# EasyEDA schematic sch_knx-valve-control_v1.2.json
TITLE: KNX 8 Heating Actuators Control; REV: 1.2; Date: 2025-16-12; Sheet: 1/1; Company: LL Production
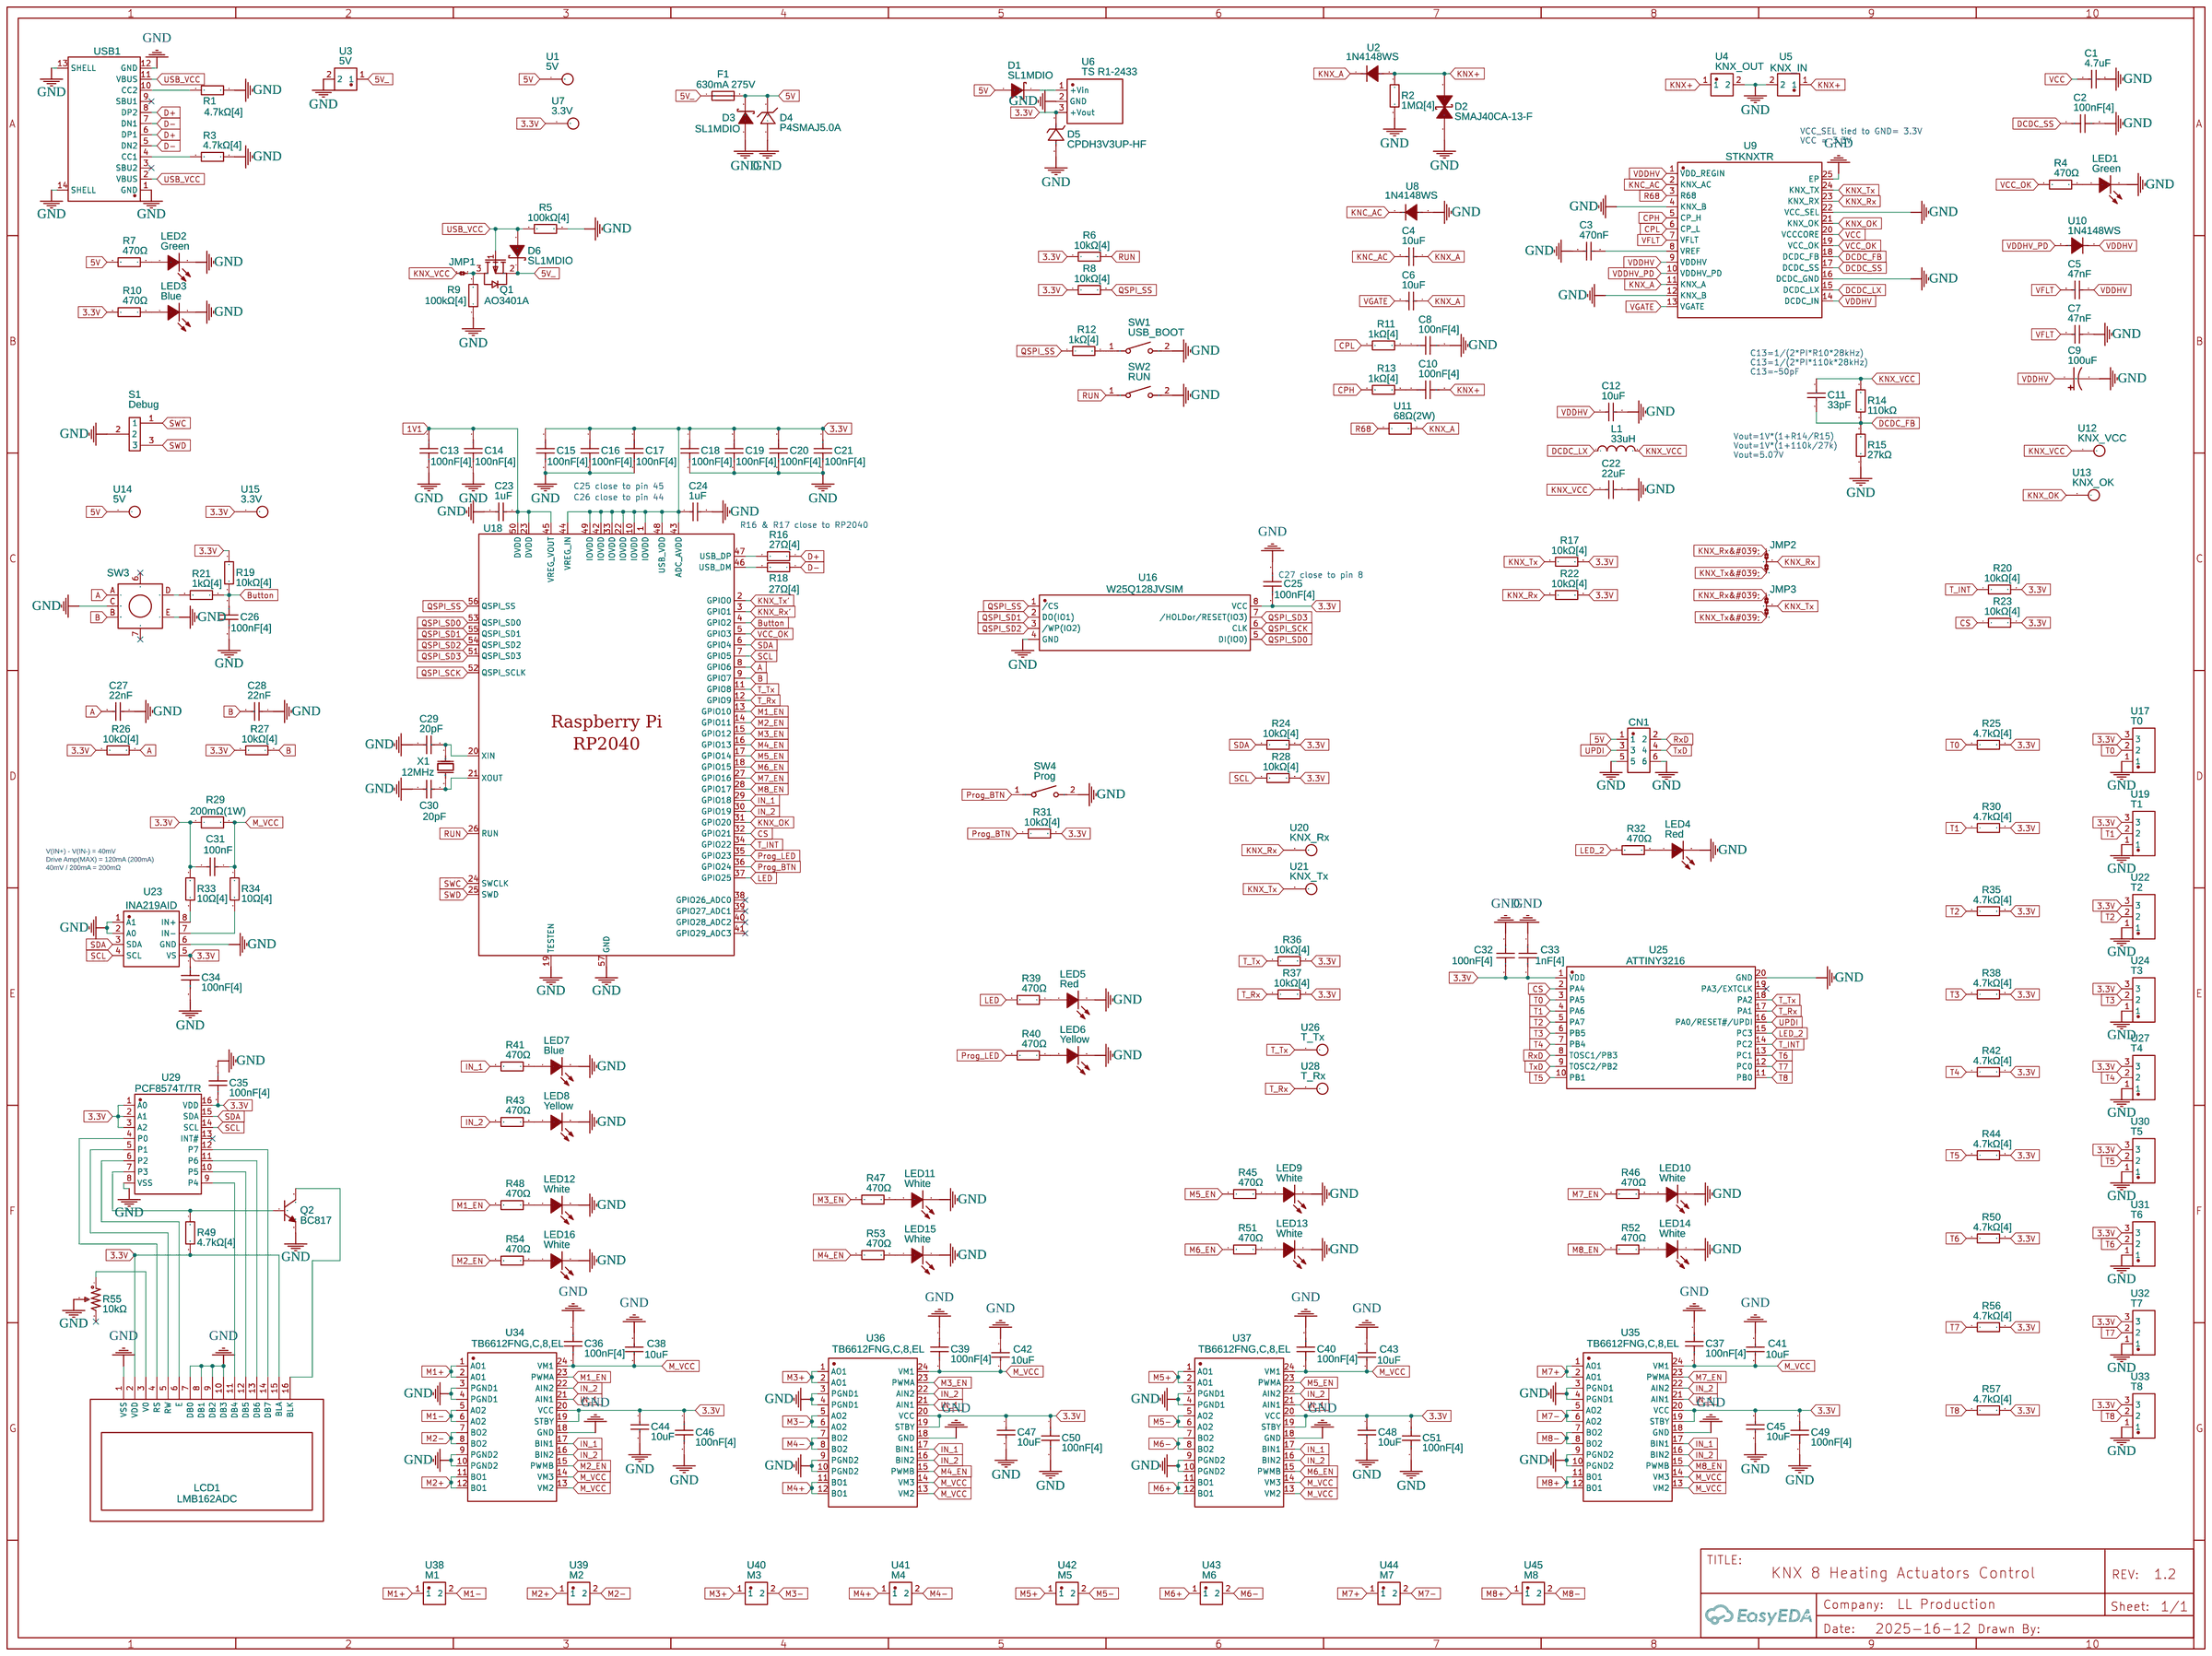
[diagram p0: schematic sheet]

## Parts
C1  4.7uF  [C0603]
C2  100nF[4]  [C0402]
C3  470nF  [C0603]
C4  10uF  [C0603]
C5  47nF  [C0603]
C6  10uF  [C0603]
C7  47nF  [C0603]
C8  100nF[4]  [C0402]
C9  100uF  [CAP-SMD_BD8.0-L8.3-W8.3-RD]
C10  100nF[4]  [C0402]
C11  33pF  [C0603]
C12  10uF  [C0603]
C13  100nF[4]  [C0402]
C14  100nF[4]  [C0402]
C15  100nF[4]  [C0402]
C16  100nF[4]  [C0402]
C17  100nF[4]  [C0402]
C18  100nF[4]  [C0402]
C19  100nF[4]  [C0402]
C20  100nF[4]  [C0402]
C21  100nF[4]  [C0402]
C22  22uF  [C0603]
C23  1uF  [C0603]
C24  1uF  [C0603]
C25  100nF[4]  [C0402]
C26  100nF[4]  [C0402]
C27  22nF  [C0603]
C28  22nF  [C0603]
C29  20pF  [C0603]
C30  20pF  [C0603]
C31  100nF  [C0603]
C32  100nF[4]  [C0402]
C33  1nF[4]  [C0402]
C34  100nF[4]  [C0402]
C35  100nF[4]  [C0402]
C36  100nF[4]  [C0402]
C37  100nF[4]  [C0402]
C38  10uF  [C0603]
C39  100nF[4]  [C0402]
C40  100nF[4]  [C0402]
C41  10uF  [C0603]
C42  10uF  [C0603]
C43  10uF  [C0603]
C44  10uF  [C0603]
C45  10uF  [C0603]
C46  100nF[4]  [C0402]
C47  10uF  [C0603]
C48  10uF  [C0603]
C49  100nF[4]  [C0402]
C50  100nF[4]  [C0402]
C51  100nF[4]  [C0402]
CN1  321006SG0ABK00A01  [IDC-TH_321006SG0ABK00A01]
D1  SL1MDIO  [SOD-123_L2.7-W1.6-LS3.7-RD]
D2  SMAJ40CA-13-F  [SMA_L4.4-W2.6-LS5.0-BI]
D3  SL1MDIO  [SOD-123_L2.7-W1.6-LS3.7-RD]
D4  P4SMAJ5.0A  [SMA_L4.3-W2.6-LS5.2-RD]
D5  CPDH3V3UP-HF  [SOD-523_L1.2-W0.8-LS1.6-RD-1]
D6  SL1MDIO  [SOD-123_L2.7-W1.6-LS3.7-RD]
F1  630mA 275V  [FUSE-SMD_L10.1-W3.1]
JMP1  Rx  [JMP-2-NO-0603]
JMP2  JMP-3-NO-0402  [JMP-3-NO-0402]
JMP3  JMP-3-NO-0402  [JMP-3-NO-0402]
L1  33uH  [IND-SMD_L4.9-W4.9_NRS50XX]
LCD1  LMB162ADC  [LCD1602]
LED1  Green  [LED0603-R-RD]
LED2  Green  [LED0603-R-RD]
LED3  Blue  [LED0603-R-RD]
LED4  Red  [LED0603-R-RD]
LED5  Red  [LED0603-R-RD]
LED6  Yellow  [LED0603-R-RD]
LED7  Blue  [LED0603-R-RD]
LED8  Yellow  [LED0603-R-RD]
LED9  White  [LED0603-R-RD]
LED10  White  [LED0603-R-RD]
LED11  White  [LED0603-R-RD]
LED12  White  [LED0603-R-RD]
LED13  White  [LED0603-R-RD]
LED14  White  [LED0603-R-RD]
LED15  White  [LED0603-R-RD]
LED16  White  [LED0603-R-RD]
Q1  AO3401A  [SOT-23-3_L2.9-W1.3-P1.90-LS2.4-BR]
Q2  BC817  [SOT-23-3_L2.9-W1.6-P1.90-LS2.8-BR]
R1  4.7kΩ[4]  [R0402]
R2  1MΩ[4]  [R0402]
R3  4.7kΩ[4]  [R0402]
R4  470Ω  [R0603]
R5  100kΩ[4]  [R0402]
R6  10kΩ[4]  [R0402]
R7  470Ω  [R0603]
R8  10kΩ[4]  [R0402]
R9  100kΩ[4]  [R0402]
R10  470Ω  [R0603]
R11  1kΩ[4]  [R0402]
R12  1kΩ[4]  [R0402]
R13  1kΩ[4]  [R0402]
R14  110kΩ  [R0603]
R15  27kΩ  [R0603]
R16  27Ω[4]  [R0402]
R17  10kΩ[4]  [R0402]
R18  27Ω[4]  [R0402]
R19  10kΩ[4]  [R0402]
R20  10kΩ[4]  [R0402]
R21  1kΩ[4]  [R0402]
R22  10kΩ[4]  [R0402]
R23  10kΩ[4]  [R0402]
R24  10kΩ[4]  [R0402]
R25  4.7kΩ[4]  [R0402]
R26  10kΩ[4]  [R0402]
R27  10kΩ[4]  [R0402]
R28  10kΩ[4]  [R0402]
R29  200mΩ(1W)  [R1206]
R30  4.7kΩ[4]  [R0402]
R31  10kΩ[4]  [R0402]
R32  470Ω  [R0603]
R33  10Ω[4]  [R0402]
R34  10Ω[4]  [R0402]
R35  4.7kΩ[4]  [R0402]
R36  10kΩ[4]  [R0402]
R37  10kΩ[4]  [R0402]
R38  4.7kΩ[4]  [R0402]
R39  470Ω  [R0603]
R40  470Ω  [R0603]
R41  470Ω  [R0603]
R42  4.7kΩ[4]  [R0402]
R43  470Ω  [R0603]
R44  4.7kΩ[4]  [R0402]
R45  470Ω  [R0603]
R46  470Ω  [R0603]
R47  470Ω  [R0603]
R48  470Ω  [R0603]
R49  4.7kΩ[4]  [R0402]
R50  4.7kΩ[4]  [R0402]
R51  470Ω  [R0603]
R52  470Ω  [R0603]
R53  470Ω  [R0603]
R54  470Ω  [R0603]
R55  10kΩ  [RES-ADJ-SMD_3P-L3.0-W3.8-P1.75-BR]
R56  4.7kΩ[4]  [R0402]
R57  4.7kΩ[4]  [R0402]
S1  Debug  [3PAD_SEL]
SW1  USB_BOOT  [SW-SMD_4P-L3.7-W3.0-P1.50-LS4.7]
SW2  RUN  [SW-SMD_4P-L3.7-W3.0-P1.50-LS4.7]
SW3  EC11L1525G01  [SW-TH_ALPS_EC11L1525G01]
SW4  Prog  [SW-SMD_4P-L3.7-W3.0-P1.50-LS4.7]
U1  5V  [THROUGH-HOLE-0.66]
U2  1N4148WS  [SOD-323_L1.7-W1.3-LS2.7-RD]
U3  5V  [CONN-TH_2P-P5.08_C9900012979]
U4  KNX_OUT  [CONN-TH_2P-P5.08_C9900012979]
U5  KNX_IN  [CONN-TH_2P-P5.08_C9900012979]
U6  TS R1-2433  [PWRM-TH_3P-L11.7-W7.6-P2.54_R1-2433]
U7  3.3V  [THROUGH-HOLE-0.66]
U8  1N4148WS  [SOD-323_L1.7-W1.3-LS2.7-RD]
U9  STKNXTR  [VFQFPN-24_L4.0-W4.0-P0.50-BL-EP2.8]
U10  1N4148WS  [SOD-323_L1.7-W1.3-LS2.7-RD]
U11  68Ω(2W)  [R2512]
U12  KNX_VCC  [THROUGH-HOLE-0.66]
U13  KNX_OK  [THROUGH-HOLE-0.66]
U14  5V  [THROUGH-HOLE-0.66]
U15  3.3V  [THROUGH-HOLE-0.66]
U16  W25Q128JVSIM  [SOIC-8_L5.2-W5.2-P1.27-LS7.9-BL]
U17  T0  [CONN-TH_3P-P5.08_DB127V-5.08-3P-GN-S]
U18  RP2040  [LQFN-56_L7.0-W7.0-P0.4-EP]
U19  T1  [CONN-TH_3P-P5.08_DB127V-5.08-3P-GN-S]
U20  KNX_Rx  [THROUGH-HOLE-0.66]
U21  KNX_Tx  [THROUGH-HOLE-0.66]
U22  T2  [CONN-TH_3P-P5.08_DB127V-5.08-3P-GN-S]
U23  INA219AID  [SOIC-8_L4.9-W3.9-P1.27-LS6.0-BL]
U24  T3  [CONN-TH_3P-P5.08_DB127V-5.08-3P-GN-S]
U25  ATTINY3216  [SOIC-20_L13.0-W7.6-P1.27-LS10.3-BL]
U26  T_Tx  [THROUGH-HOLE-0.66]
U27  T4  [CONN-TH_3P-P5.08_DB127V-5.08-3P-GN-S]
U28  T_Rx  [THROUGH-HOLE-0.66]
U29  PCF8574T/TR  [SO-16_L10.3-W7.5-P1.27-LS10.3-BL]
U30  T5  [CONN-TH_3P-P5.08_DB127V-5.08-3P-GN-S]
U31  T6  [CONN-TH_3P-P5.08_DB127V-5.08-3P-GN-S]
U32  T7  [CONN-TH_3P-P5.08_DB127V-5.08-3P-GN-S]
U33  T8  [CONN-TH_3P-P5.08_DB127V-5.08-3P-GN-S]
U34  TB6612FNG,C,8,EL  [SSOP-24_L8.3-W5.6-P0.65-LS7.6-BL]
U35  TB6612FNG,C,8,EL  [SSOP-24_L8.3-W5.6-P0.65-LS7.6-BL]
U36  TB6612FNG,C,8,EL  [SSOP-24_L8.3-W5.6-P0.65-LS7.6-BL]
U37  TB6612FNG,C,8,EL  [SSOP-24_L8.3-W5.6-P0.65-LS7.6-BL]
U38  M1  [CONN-TH_2P-P5.08_C9900012979]
U39  M2  [CONN-TH_2P-P5.08_C9900012979]
U40  M3  [CONN-TH_2P-P5.08_C9900012979]
U41  M4  [CONN-TH_2P-P5.08_C9900012979]
U42  M5  [CONN-TH_2P-P5.08_C9900012979]
U43  M6  [CONN-TH_2P-P5.08_C9900012979]
U44  M7  [CONN-TH_2P-P5.08_C9900012979]
U45  M8  [CONN-TH_2P-P5.08_C9900012979]
USB1  TYPE-C 16PIN 2MD(073)  [USB-C-SMD_TYPE-C-6PIN-2MD-073]
X1  12MHz  [OSC-SMD_L5.0-W3.2]

## Library data of the parts
C1 C3-C7 C11 C12 C22-C24 C27-C31 C38 C41-C45 C47 C48 = CC0603KRX7R9BB103: Supplier: LCSC; Manufacturer: YAGEO; Supplier Part: C100042; JLCPCB Part Class: Extended Part
C2 C8 C10 C13-C21 C25 C26 C32-C37 C39 C40 C46 C49-C51 = GRM155R71H104KE14D: Supplier: LCSC; Manufacturer: muRata(村田); Supplier Part: C77020; JLCPCB Part Class: Extended Part
C9 = VEJ101M1HTR-0810: Contributor: LCSC; Supplier: LCSC; Supplier Part: C176665; Manufacturer: Lelon(立隆); JLCPCB Part Class: Extended Part
CN1 = 321006SG0ABK00A01: Contributor: LCSC; Supplier: LCSC; Supplier Part: C601936; Manufacturer: JILN(锦凌); JLCPCB Part Class: Extended Part; link: https://lcsc.com/eda_search?q=C601936&%26type=1&ref=editor
D1 D3 D6 = 1N5819HW-7-F: Supplier: LCSC; Manufacturer: DIODES(美台); Supplier Part: C82544; JLCPCB Part Class: Extended Part
D2 = SMAJ40CA-13-F: Contributor: LCSC; Supplier: LCSC; Manufacturer: DIODES(美台); Supplier Part: C134986; JLCPCB Part Class: Extended Part
D4 = P4SMAJ12A-PEC: Contributor: LCSC; Supplier: LCSC; Supplier Part: C263332; Manufacturer: PANJIT(强茂); Manufacturer Part: P4SMAJ12A_R1_00001; JLCPCB Part Class: Extended Part
D5 = SOD-523: Contributor: LCSC; Supplier: LCSC; Supplier Part: C9900005315; Manufacturer: null; JLCPCB Part Class: Extended Part
F1 = S1032-F-60.0A: Contributor: LCSC; Supplier: LCSC; Supplier Part: C553920; Manufacturer: SART(萨特); JLCPCB Part Class: Extended Part
JMP1 = JMP-2-NO-0603: Two Terminal Jumper - Normally Open; Contributor: PatternAgents
JMP2 JMP3 = JMP-3-NO-0402: Three Terminal Jumper - Normally Open; Contributor: PatternAgents
L1 = NR5040T330M: Supplier: LCSC; Manufacturer: TAIYO YUDEN(太诱); Supplier Part: C92937; JLCPCB Part Class: Extended Part
LCD1 = LMB162ADC: Supplier: LCSC; Manufacturer: TOPWAY; Supplier Part: C9741
LED1-LED16 = SZYY0603R: Supplier: LCSC; Supplier Part: C434419; Manufacturer: yongyu(永裕光电); Contributor: LCSC; JLCPCB Part Class: Extended Part
Q1 = AO3401A_C700954: Supplier: LCSC; Supplier Part: C700954; Manufacturer: HUASHUO(华朔); Contributor: LCSC; JLCPCB Part Class: Extended Part; Package Display: No
Q2 = BC817-40,215: Supplier: LCSC; Manufacturer: Nexperia(安世); Supplier Part: C52801; JLCPCB Part Class: Extended Part
R1-R3 R5 R6 R8 R9 R11-R13 R16-R28 R30 R31 R33-R38 R42 R44 R49 R50 R56 R57 = 0402WGF1002TCE: Supplier: LCSC; Manufacturer: UNI-ROYAL(厚声); Supplier Part: C25744; JLCPCB Part Class: Basic Part
R4 R7 R10 R14 R15 R32 R39-R41 R43 R45-R48 R51-R54 = CR0603FA1001G_C126900: Supplier: LCSC; Manufacturer: LIZ(丽智电子); Manufacturer Part: CR0603FA1001G; Supplier Part: C126900; Resistance (Ohms): 1K; JLCPCB Part Class: Extended Part
R29 = SCR1206F1M1: Supplier: LCSC; Supplier Part: C3017245; Manufacturer: VO(翔胜); JLCPCB Part Class: Extended Part; Contributor: lcsc
R55 = TC33X-2-103E: Contributor: LCSC; Supplier: LCSC; Supplier Part: C719176; Manufacturer: BOURNS; JLCPCB Part Class: Extended Part
S1 = 3PAD_SEL: Contributor: SSM-PCB-Team
SW1 SW2 SW4 = TS-1185EC-C-D-B: Contributor: LCSC; Supplier: LCSC; Supplier Part: C318893; Manufacturer: XKB Connection(中国星坤); JLCPCB Part Class: Extended Part
SW3 = EC11L1525G01: Contributor: lcsc; Supplier: LCSC; Supplier Part: C2991196; Manufacturer: ALPSALPINE(阿尔卑斯阿尔派); JLCPCB Part Class: Extended Part; link: https://lcsc.com/eda_search?q=C2991196&%26type=1&ref=editor
U1 U7 U12-U15 U20 U21 U26 U28 = Through hole: Contributor: tuble78
U2 U8 U10 = 1N4148WS: Supplier: LCSC; Supplier Part: C19272188; Manufacturer: Zhengxin(正芯); Contributor: lcsc
U3-U5 U38-U45 = 2P,间距5.08MM,弹片压线升降式: Supplier: LCSC; Supplier Part: C9900012979; Manufacturer: null; Manufacturer Part: 2P,间距5.08mm,弹片压线升降式; Contributor: LCSC; JLCPCB Part Class: Extended Part
U6 = TS R1-2433: Supplier: LCSC; Supplier Part: C5455553; Manufacturer: TRACO POWER; JLCPCB Part Class: Extended Part; Contributor: lcsc
U9 = STKNXTR: Contributor: LCSC; Supplier: LCSC; Supplier Part: C2671486; Manufacturer: ST(意法半导体); JLCPCB Part Class: Extended Part
U11 = HOJLR2512-3W-3.5MR-1%: Contributor: lcsc; Supplier: LCSC; Supplier Part: C2904235; Manufacturer: Milliohm(毫欧); Manufacturer Part: HoJLR2512-3W-3.5mR-1%; JLCPCB Part Class: Extended Part
U16 = W25Q128JVSIM: Contributor: LCSC; Supplier: LCSC; Supplier Part: C2613930; Manufacturer: WINBOND(华邦); JLCPCB Part Class: Extended Part
U17 U19 U22 U24 U27 U30-U33 = DB127V-5.08-3P-GN-S: Supplier: LCSC; Supplier Part: C3018699; Manufacturer: DIBO(地博电气); link: https://atta.szlcsc.com/upload/public/pdf/source/20230106/9E8F75CF958F44CA83513B3CECA15E79.pdf; Contributor: lcsc; JLCPCB Part Class: Extended Part
U18 = RP2040: Contributor: LCSC; Supplier: LCSC; Supplier Part: C2040; Manufacturer: Raspberry Pi(树莓派); JLCPCB Part Class: Extended Part
U23 = INA219AID: Contributor: lcsc; Supplier: LCSC; Supplier Part: C1574856; Manufacturer: TI(德州仪器); JLCPCB Part Class: Extended Part
U25 = ATTINY1616-SN_C614136: Contributor: lcsc; Supplier: LCSC; Supplier Part: C614136; Manufacturer: MICROCHIP(美国微芯); Manufacturer Part: ATTINY1616-SN; link: https://lcsc.com/eda_search?q=C614136&%26type=1&ref=editor
U29 = PCF8574T/TR: Supplier: LCSC; Supplier Part: C2987288; Manufacturer: HGSEMI(华冠); link: https://atta.szlcsc.com/upload/public/pdf/source/20190611/C398075_1925312D8618E19C6137781D5B71A3CA.pdf; Contributor: lcsc; JLCPCB Part Class: Extended Part
U34-U37 = TB6612FNG,C,8,EL: Contributor: LCSC; Supplier: LCSC; Manufacturer: TOSHIBA(东芝); Supplier Part: C141517; JLCPCB Part Class: Extended Part
USB1 = TYPE-C 16PIN 2MD(073): Contributor: LCSC; Supplier: LCSC; Supplier Part: C2765186; Manufacturer: SHOU HAN(首韩); JLCPCB Part Class: Extended Part
X1 = SMD-5032_2P 12M 20pf 30ppm: Contributor: LCSC; Supplier: LCSC; Supplier Part: C122521; Manufacturer: YJX(雅晶鑫); Manufacturer Part: TAXM12M2QLFCDT1T; JLCPCB Part Class: Extended Part

## Nets
1V1: C13.1 C14.1 C23.2 U18.23(DVDD) U18.45(VREG_VOUT) U18.50(DVDD)
3.3V: C15.1 C16.1 C17.1 C18.1 C19.1 C20.1 C21.1 C24.1 C25.2 C31.2 C32.2 C33.2 C34.1 C35.2 C44.1 C45.1 C46.1 C47.1 C48.1 C49.1 C50.1 C51.1 D5.1(K) LCD1.2(VDD) LCD1.15(BLA) R6.1 R8.1 R10.2 R17.2 R19.1 R20.2 R22.2 R23.2 R24.2 R25.2 R26.1 R27.1 R28.2 R29.1 R30.2 R31.2 R33.1 R35.2 R36.2 R37.2 R38.2 R42.2 R44.2 R49.2 R50.2 R56.2 R57.2 U6.3(+Vout) U7.1 U15.1 U16.8(VCC) U17.3 U18.1(IOVDD) U18.10(IOVDD) U18.22(IOVDD) U18.33(IOVDD) U18.42(IOVDD) U18.43(ADC_AVDD) U18.44(VREG_IN) U18.48(USB_VDD) U18.49(IOVDD) U19.3 U22.3 U23.5(VS) U24.3 U25.1(VDD) U27.3 U29.1(A0) U29.2(A1) U29.3(A2) U29.16(VDD) U30.3 U31.3 U32.3 U33.3 U34.19(STBY) U34.20(VCC) U35.19(STBY) U35.20(VCC) U36.19(STBY) U36.20(VCC) U37.19(STBY) U37.20(VCC)
5V: CN1.1 D1.2(A) D3.1(K) D4.1(C) F1.2 R7.2 U1.1 U14.1
5V_: D6.1(K) F1.1 Q1.2(S) U3.1
GND: C1.1 C2.2 C3.1 C7.1 C8.2 C9.2 C12.2 C13.2 C14.2 C15.2 C16.2 C17.2 C18.2 C19.2 C20.2 C21.2 C22.2 C23.1 C24.2 C25.1 C26.2 C27.1 C28.1 C29.1 C30.1 C32.1 C33.1 C34.2 C35.1 C36.1 C37.1 C38.1 C39.1 C40.1 C41.1 C42.1 C43.1 C44.2 C45.2 C46.2 C47.2 C48.2 C49.2 C50.2 C51.2 CN1.5 CN1.6 D2.2 D3.2(A) D4.2(A) D5.2(A) LCD1.1(VSS) LCD1.7(DB0) LCD1.8(DB1) LCD1.9(DB2) LCD1.10(DB3) LED1.2(-) LED2.2(-) LED3.2(-) LED4.2(-) LED5.2(-) LED6.2(-) LED7.2(-) LED8.2(-) LED9.2(-) LED10.2(-) LED11.2(-) LED12.2(-) LED13.2(-) LED14.2(-) LED15.2(-) LED16.2(-) Q2.2 R1.1 R2.2 R3.1 R5.2 R9.1 R15.1 R55.2 S1.2 SW1.2 SW2.2 SW3.C SW3.E SW4.2 U3.2 U4.2 U5.2 U6.2(GND) U8.2(A) U9.4(KNX_B) U9.12(KNX_B) U9.16(DCDC_GND) U9.22(VCC_SEL) U9.25(EP) U16.4(GND) U17.1 U18.19(TESTEN) U18.57(GND) U19.1 U22.1 U23.1(A1) U23.2(A0) U23.6(GND) U24.1 U25.20(GND) U27.1 U29.8(VSS) U30.1 U31.1 U32.1 U33.1 U34.3(PGND1) U34.4(PGND1) U34.9(PGND2) U34.10(PGND2) U34.18(GND) U35.3(PGND1) U35.4(PGND1) U35.9(PGND2) U35.10(PGND2) U35.18(GND) U36.3(PGND1) U36.4(PGND1) U36.9(PGND2) U36.10(PGND2) U36.18(GND) U37.3(PGND1) U37.4(PGND1) U37.9(PGND2) U37.10(PGND2) U37.18(GND) USB1.1(GND) USB1.12(GND) USB1.13(SHELL) USB1.14(SHELL)
VCC: C1.2 U9.20(VCCCORE)
VCC_OK: R4.2 U9.19(VCC_OK) U18.5(GPIO3)
VDDHV: C5.1 C9.1 C12.1 U9.1(VDD_REGIN) U9.9(VDDHV) U9.14(DCDC_IN) U10.1(K)
VDDHV_PD: U9.10(VDDHV_PD) U10.2(A)
A: C27.2 R26.2 SW3.A U18.8(GPIO6)
B: C28.2 R27.2 SW3.B U18.9(GPIO7)
Button: C26.1 R19.2 R21.1 U18.4(GPIO2)
CPH: R13.1 U9.5(CP_H)
CPL: R11.1 U9.6(CP_L)
CS: R23.1 U18.32(GPIO21) U25.2(PA4)
D+: R16.1 USB1.6(DP1) USB1.8(DP2)
D-: R18.1 USB1.5(DN2) USB1.7(DN1)
DCDC_FB: C11.2 R14.1 R15.2 U9.18(DCDC_FB)
DCDC_LX: L1.1 U9.15(DCDC_LX)
DCDC_SS: C2.1 U9.17(DCDC_SS)
IN_1: R41.2 U18.29(GPIO18) U34.17(BIN1) U34.21(AIN1) U35.17(BIN1) U35.21(AIN1) U36.17(BIN1) U36.21(AIN1) U37.17(BIN1) U37.21(AIN1)
IN_2: R43.2 U18.30(GPIO19) U34.16(BIN2) U34.22(AIN2) U35.16(BIN2) U35.22(AIN2) U36.16(BIN2) U36.22(AIN2) U37.16(BIN2) U37.22(AIN2)
KNC_AC: C4.2 U8.1(K) U9.2(KNX_AC)
KNX+: C10.2 D2.1 R2.1 U2.2(A) U4.1 U5.1
KNX_A: C4.1 C6.1 U2.1(K) U9.11(KNX_A) U11.2
KNX_OK: U9.21(KNX_OK) U13.1 U18.31(GPIO20)
KNX_Rx: JMP2.2 R22.1 U9.23(KNX_RX) U20.1
KNX_Rx&#039;: JMP2.1 JMP3.1
KNX_Rx': U18.3(GPIO1)
KNX_Tx: JMP3.2 R17.1 U9.24(KNX_TX) U21.1
KNX_Tx&#039;: JMP2.3 JMP3.3
KNX_Tx': U18.2(GPIO0)
KNX_VCC: C11.1 C22.1 JMP1.1 L1.2 R14.2 U12.1
LED: R39.2 U18.37(GPIO25)
LED_2: R32.2 U25.15(PC3)
M1+: U34.1(AO1) U34.2(AO1) U38.1
M1-: U34.5(AO2) U34.6(AO2) U38.2
M1_EN: R48.2 U18.13(GPIO10) U34.23(PWMA)
M2+: U34.11(BO1) U34.12(BO1) U39.1
M2-: U34.7(BO2) U34.8(BO2) U39.2
M2_EN: R54.2 U18.14(GPIO11) U34.15(PWMB)
M3+: U36.1(AO1) U36.2(AO1) U40.1
M3-: U36.5(AO2) U36.6(AO2) U40.2
M3_EN: R47.2 U18.15(GPIO12) U36.23(PWMA)
M4+: U36.11(BO1) U36.12(BO1) U41.1
M4-: U36.7(BO2) U36.8(BO2) U41.2
M4_EN: R53.2 U18.16(GPIO13) U36.15(PWMB)
M5+: U37.1(AO1) U37.2(AO1) U42.1
M5-: U37.5(AO2) U37.6(AO2) U42.2
M5_EN: R45.2 U18.17(GPIO14) U37.23(PWMA)
M6+: U37.11(BO1) U37.12(BO1) U43.1
M6-: U37.7(BO2) U37.8(BO2) U43.2
M6_EN: R51.2 U18.18(GPIO15) U37.15(PWMB)
M7+: U35.1(AO1) U35.2(AO1) U44.1
M7-: U35.5(AO2) U35.6(AO2) U44.2
M7_EN: R46.2 U18.27(GPIO16) U35.23(PWMA)
M8+: U35.11(BO1) U35.12(BO1) U45.1
M8-: U35.7(BO2) U35.8(BO2) U45.2
M8_EN: R52.2 U18.28(GPIO17) U35.15(PWMB)
M_VCC: C31.1 C36.2 C37.2 C38.2 C39.2 C40.2 C41.2 C42.2 C43.2 R29.2 R34.1 U34.13(VM2) U34.14(VM3) U34.24(VM1) U35.13(VM2) U35.14(VM3) U35.24(VM1) U36.13(VM2) U36.14(VM3) U36.24(VM1) U37.13(VM2) U37.14(VM3) U37.24(VM1)
Prog_BTN: R31.1 SW4.1 U18.36(GPIO24)
Prog_LED: R40.2 U18.35(GPIO23)
QSPI_SCK: U16.6(CLK) U18.52(QSPI_SCLK)
QSPI_SD0: U16.5(DI(IO0)) U18.53(QSPI_SD0)
QSPI_SD1: U16.2(DO(IO1)) U18.55(QSPI_SD1)
QSPI_SD2: U16.3(/WP(IO2)) U18.54(QSPI_SD2)
QSPI_SD3: U16.7(/HOLDor/RESET(IO3)) U18.51(QSPI_SD3)
QSPI_SS: R8.2 R12.1 U16.1(/CS) U18.56(QSPI_SS)
R68: U9.3(R68) U11.1
RUN: R6.2 SW2.1 U18.26(RUN)
RxD: CN1.2 U25.8(TOSC1/PB3)
SCL: R28.1 U18.7(GPIO5) U23.4(SCL) U29.14(SCL)
SDA: R24.1 U18.6(GPIO4) U23.3(SDA) U29.15(SDA)
SWC: S1.1 U18.24(SWCLK)
SWD: S1.3 U18.25(SWD)
T0: R25.1 U17.2 U25.3(PA5)
T1: R30.1 U19.2 U25.4(PA6)
T2: R35.1 U22.2 U25.5(PA7)
T3: R38.1 U24.2 U25.6(PB5)
T4: R42.1 U25.7(PB4) U27.2
T5: R44.1 U25.10(PB1) U30.2
T6: R50.1 U25.13(PC1) U31.2
T7: R56.1 U25.12(PC0) U32.2
T8: R57.1 U25.11(PB0) U33.2
T_INT: R20.1 U18.34(GPIO22) U25.14(PC2)
T_Rx: R37.1 U18.12(GPIO9) U25.17(PA1) U28.1
T_Tx: R36.1 U18.11(GPIO8) U25.18(PA2) U26.1
TxD: CN1.4 U25.9(TOSC2/PB2)
UPDI: CN1.3 U25.16(PA0/RESET#/UPDI)
USB_VCC: D6.2(A) Q1.1(G) R5.1 USB1.2(VBUS) USB1.11(VBUS)
VFLT: C5.2 C7.2 U9.7(VFLT)
VGATE: C6.2 U9.13(VGATE)
Net-(C3-2): C3.2 U9.8(VREF)
Net-(C8-1): C8.1 R11.2
Net-(C10-1): C10.1 R13.2
Net-(C29-2): C29.2 U18.20(XIN) X1.1(OSC1)
Net-(C30-2): C30.2 U18.21(XOUT) X1.2(OSC2)
Net-(D1-1): D1.1(K) U6.1(+Vin)
Net-(JMP1-2): JMP1.2 Q1.3(D) R9.2
Net-(LCD1-3): LCD1.3(V0) R55.1
Net-(LCD1-4): LCD1.4(RS) U29.4(P0)
Net-(LCD1-5): LCD1.5(RW) U29.5(P1)
Net-(LCD1-6): LCD1.6(E) U29.6(P2)
Net-(LCD1-11): LCD1.11(DB4) U29.9(P4)
Net-(LCD1-12): LCD1.12(DB5) U29.10(P5)
Net-(LCD1-13): LCD1.13(DB6) U29.11(P6)
Net-(LCD1-14): LCD1.14(DB7) U29.12(P7)
Net-(LCD1-16): LCD1.16(BLK) Q2.3
Net-(LED1-1): LED1.1(+) R4.1
Net-(LED2-1): LED2.1(+) R7.1
Net-(LED3-1): LED3.1(+) R10.1
Net-(LED4-1): LED4.1(+) R32.1
Net-(LED5-1): LED5.1(+) R39.1
Net-(LED6-1): LED6.1(+) R40.1
Net-(LED7-1): LED7.1(+) R41.1
Net-(LED8-1): LED8.1(+) R43.1
Net-(LED9-1): LED9.1(+) R45.1
Net-(LED10-1): LED10.1(+) R46.1
Net-(LED11-1): LED11.1(+) R47.1
Net-(LED12-1): LED12.1(+) R48.1
Net-(LED13-1): LED13.1(+) R51.1
Net-(LED14-1): LED14.1(+) R52.1
Net-(LED15-1): LED15.1(+) R53.1
Net-(LED16-1): LED16.1(+) R54.1
Net-(Q2-1): Q2.1 R49.1 U29.7(P3)
Net-(R1-2): R1.2 USB1.10(CC2)
Net-(R3-2): R3.2 USB1.4(CC1)
Net-(R12-2): R12.2 SW1.1
Net-(R16-2): R16.2 U18.47(USB_DP)
Net-(R18-2): R18.2 U18.46(USB_DM)
Net-(R21-2): R21.2 SW3.D
Net-(R33-2): R33.2 U23.8(IN+)
Net-(R34-2): R34.2 U23.7(IN-)

Not connected (* = marked no-connect by the designer): R55 3*; SW3 6(EH)* 7(EH)*; U18 38(GPIO26_ADC0)* 39(GPIO27_ADC1)* 40(GPIO28_ADC2)* 41(GPIO29_ADC3)*; U25 19(PA3/EXTCLK)*; U29 13(INT#)*; USB1 3(SBU2)* 9(SBU1)*

## Notes on the sheet
- VCC_SEL tied to GND= 3.3V
  VCC = 3.3V
- C13=1/(2*PI*R10*28kHz)
  C13=1/(2*PI*110k*28kHz)
  C13=~50pF
- Vout=1V*(1+R14/R15)
  Vout=1V*(1+110k/27k)
  Vout=5.07V
- C25 close to pin 45
- C26 close to pin 44
- R16 & R17 close to RP2040
- C27 close to pin 8
- V(IN+) - V(IN-) = 40mV
  Drive Amp(MAX) = 120mA (200mA)
  40mV / 200mA = 200mΩ
